# Altium schematic sheet SD.SchDoc
size A
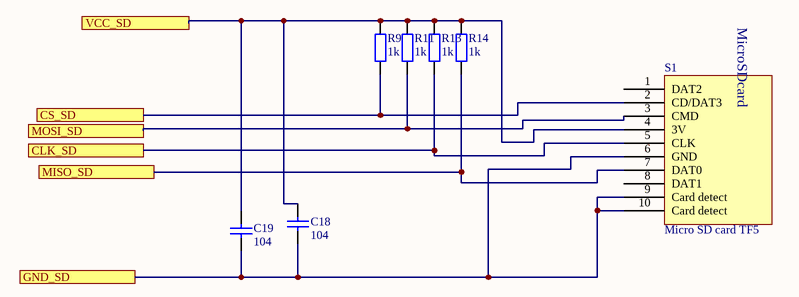
[diagram p0: SD.SchDoc]

## Parts
C18  104  [tu 0805]
C19  104  [tu 0805]
R9  1k  [tro smd 0805]
R11  1k  [tro smd 0805]
R13  1k  [tro smd 0805]
R14  1k  [tro smd 0805]
S1  Micro SD card TF5  [MicroSD TF V5]

## Ports
CLK_SD, CS_SD, GND_SD, MISO_SD, MOSI_SD, VCC_SD

## Nets
CLK_SD: R13.1 S1.5(CLK) ; port CLK_SD
CS_SD: R9.2 S1.2(CD/DAT3) ; port CS_SD
GND_SD: C18.2 C19.2 S1.6(GND) S1.9(Card_detect) S1.10(Card_detect) ; port GND_SD
MISO_SD: R14.1 S1.7(DAT0) ; port MISO_SD
MOSI_SD: R11.1 S1.3(CMD) ; port MOSI_SD
VCC_SD: C18.1 C19.1 R9.1 R11.2 R13.2 R14.2 S1.4(3V) ; port VCC_SD

Not connected (* = marked no-connect by the designer): S1 1(DAT2) 8(DAT1)

## Notes on the sheet
- (in symbol Micro SD card TF5) MicroSDcard

## Library data of the parts
C18 C19 = Tu 0805 104 50V 10%: Dán; Don_Vi: Con; So_Chan: 2; Ten_Linh_Kien: Tụ 0805 104-100nF 10% 50V; Ma_Hang: MH004551; Chung_Loai: Dán; Kieu_Chan: *
R9 R11 R13 R14 = Tro 0805 1% 1k: Dán; Don_Vi: Con; So_Chan: 2; Ten_Linh_Kien: Trở 0805 1% 1k; Ma_Hang: MH005468; Chung_Loai: Dán; Kieu_Chan: *